# EAGLE design pcb (EAGLE 6.1)
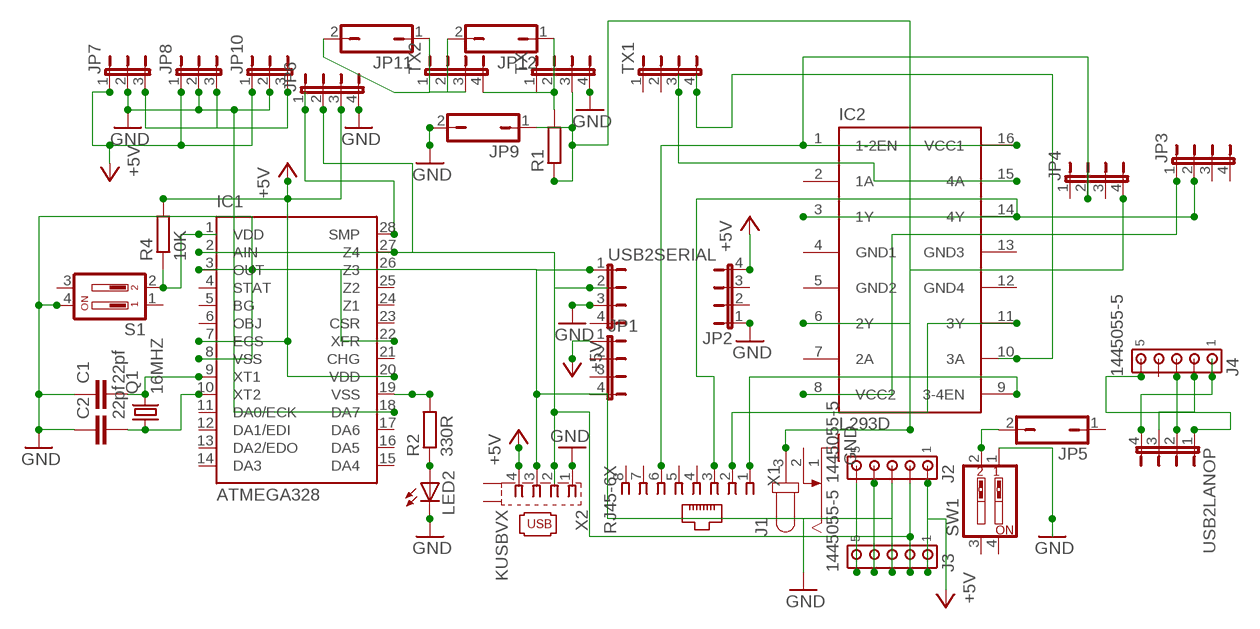
[diagram p0: schematic, sheet 1]

## Parts
C1  22pf  C2.5/2  [C2.5-2]
C2  22pf  C2.5/2  [C2.5-2]
IC1  ATMEGA328  QT9701BD  [DIL28-3]
IC2  L293D  [DIL16]
J1  JACK-PLUG0  [SPC4077]
J2  1445055-5  [1445055-5]
J3  1445055-5  [1445055-5]
J4  1445055-5  [1445055-5]
JP1  JP4E  [JP4]
JP2  JP4E  [JP4]
JP3  JP4E  [JP4]
JP4  JP4E  [JP4]
JP5  JP1Q  [JP1]
JP6  JP4E  [JP4]
JP7  JP2E  [JP2]
JP8  JP2E  [JP2]
JP9  JP1Q  [JP1]
JP10  JP2E  [JP2]
JP11  JP1Q  [JP1]
JP12  JP1Q  [JP1]
LED2  LED3MM  [LED3MM]
Q1  16MHZ  CRYSTALHC49S  [HC49/S]
R1  R-EU_0204/7  [0204/7]
R2  330R  R-EU_0207/10  [0207/10]
R4  10K  R-EU_0207/10  [0207/10]
S1  DP02  [DP-02]
SW1  SW_DIP-2  [EDG-02]
TX  JP4E  [JP4]
TX1  JP4E  [JP4]
TX2  JP4E  [JP4]
USB2LANOP  JP4E  [JP4]
USB2SERIAL  JP4E  [JP4]
X1  RJ45-6X  [RJ45-NO-SHIELD]
X2  KUSBVX  [KUSBVX]

## Nets
+5V: IC1.7(ECS) IC1.20(VDD) J2.1 J3.1 JP1.1 JP2.4 JP6.3 JP7.1 JP8.1 JP10.1 R4.2 X2.4
GND: C1.1 C2.1 IC1.8(VSS) IC1.18(DA7) IC1.22(XFR) J1.1 J2.5 J3.5 JP2.1 JP6.4 JP7.2 JP8.2 JP9.2 JP10.2 LED2.K(C) S1.4 SW1.1 TX.4 USB2SERIAL.3 X2.1
N$1: C1.2 IC1.9(XT1) Q1.2
N$2: C2.2 IC1.10(XT2) Q1.1
N$3: J4.1 USB2LANOP.4
N$4: IC1.3(OUT) J2.3 J3.3 USB2SERIAL.1 X2.3
N$5: IC1.19(VSS) R2.2
N$6: IC2.9(3-4EN) X1.1
N$7: IC2.11(3Y) X1.2
N$8: IC2.14(4Y) X1.3
N$9: IC2.16(VCC1) X1.6
N$10: IC2.8(VCC2) JP3.1
N$11: IC2.6(2Y) JP4.4
N$12: IC2.3(1Y) JP3.2
N$13: IC2.1(1-2EN) JP4.2
N$14: IC2.10(3A) TX1.4
N$15: IC2.15(4A) TX1.3
N$16: J1.3 JP9.1 R1.1 TX.3
N$17: R1.2 TX.2
N$18: J4.2 USB2LANOP.3
N$19: J4.3 USB2LANOP.2
N$20: IC1.2(AIN) J2.2 J3.2 USB2SERIAL.2 X2.2
N$21: J4.5 USB2LANOP.1
N$22: J2.4 J3.4
N$23: JP5.2 SW1.2
N$24: IC1.27(Z4) JP6.2
N$25: IC1.28(SMP) JP6.1
N$26: JP7.3 JP8.3 JP10.3
N$27: JP11.2 TX2.1
N$28: JP11.1 TX2.2
N$29: JP12.2 TX2.3
N$30: JP12.1 TX2.4
N$31: IC1.1(VDD) R4.1 S1.2
N$32: LED2.A R2.1
Unconnected: IC1.4(STAT) IC1.5(BG) IC1.6(OBJ) IC1.11(DA0/ECK) IC1.12(DA1/EDI) IC1.13(DA2/EDO) IC1.14(DA3) IC1.15(DA4) IC1.16(DA5) IC1.17(DA6) IC1.21(CHG) IC1.23(CSR) IC1.24(Z1) IC1.25(Z2) IC1.26(Z3) IC2.2(1A) IC2.7(2A) J1.2 J4.4 JP1.2 JP1.3 JP1.4 JP2.2 JP2.3 JP3.3 JP3.4 JP4.1 JP4.3 JP5.1 S1.1 S1.3 SW1.3 SW1.4 TX1.1 TX1.2 TX.1 USB2SERIAL.4 X1.4 X1.5 X1.7 X1.8 X2.M1(S1) X2.M2(S2)

## Power pins joined to a net without a drawn wire
GND1: IC2.4(GND1)
GND2: IC2.5(GND2)
GND3: IC2.13(GND3)
GND4: IC2.12(GND4)

## Library data of the parts
C1 C2 = capacitor-wima:C: CAPACITOR naming: grid - package width
IC1 = quantum-research-group:QT9701B: Charge-Transfer Capacitance Sensor IC Source: http://data.qprox.com/downloads/datasheets/qt9701b.pdf; OC_FARNELL: unknown; OC_NEWARK: unknown
IC2 = st-microelectronics:L293D: PUSH-PULL 4 CHANNEL DRIVER; MPN: L293D; OC_FARNELL: 9589619; OC_NEWARK: 56P8249
J1 = con-jack:JACK-PLUG: DC POWER JACK Power Jack, DC, Right Angle, Through Hole, Rated 5A at 16VDC, PC Terminals Distributor: Farnell (www.Farnell.de) Drawing: 84N1161.pdf / 84N1162.pdf Manufacturer: SPC Technology (www.spctechnology.com) Type: SPC4077 / SPC 4078; OC_FARNELL: unknown; OC_NEWARK: unknown
J2-J4 = con-amp:1445055-5: Micro MATE-N-LOK Connectors grid 1.5 mm Source: ENG_CD_1445055_A.pdf
JP1-JP4 JP6 TX TX1 TX2 USB2LANOP USB2SERIAL = jumper:JP4E: JUMPER
JP5 JP9 JP11 JP12 = jumper:JP1Q: JUMPER
JP7 JP8 JP10 = jumper:JP2E: JUMPER
LED2 = led:LED: LED OSRAM: - CHIPLED LG R971, LG N971, LY N971, LG Q971, LY Q971, LO R971, LY R971 LH N974, LH R974 LS Q976, LO Q976, LY Q976 LO Q996 - Hyper CHIPLED LW Q18S LB Q993, LB Q99A, LB R99A - SideLED LS A670, LO A670, LY A670, LG A670, LP A670 LB A673, LV A673, LT A673, LW A673 LH A674 LY A675 LS A676, LA A676, LO A676, LY A676, LW A676 LS A679, LY A679, LG A679 - Hyper Micro SIDELED® LS Y876, LA Y876, LO Y876, LY Y876 LT Y87S - SmartLED LW L88C, LW L88S LB L89C, LB L89S, LG L890 LS L89K, LO L89K, LY L89K LS L896, LA L896, LO L896, LY L896 - TOPLED LS T670, LO T670, LY T670, LG T670, LP T670 LSG T670, LSP T670, LSY T670, LOP T670, LYG T670 LG T671, LOG T671, LSG T671 LB T673, LV T673, LT T673, LW T673 LH T674 LS T676, LA T676, LO T676, LY T676, LB T676, LH T676, LSB T676, LW T676 LB T67C, LV T67C, LT T67C, LS T67K, LO T67K, LY T67K, LW E67C LS E67B, LA E67B, LO E67B, LY E67B, LB E67C, LV E67C, LT E67C LW T67C LS T679, LY T679, LG T679 LS T770, LO T770, LY T770, LG T770, LP T770 LB T773, LV T773, LT T773, LW T773 LH T774 LS E675, LA E675, LY E675, LS T675 LS T776, LA T776, LO T776, LY T776, LB T776 LHGB T686 LT T68C, LB T68C - Hyper Mini TOPLED® LB M676 - Mini TOPLED Santana® LG M470 LS M47K, LO M47K, LY M47K Source: http://www.osram.convergy.de LUXEON: - LUMILED® LXK2-PW12-R00, LXK2-PW12-S00, LXK2-PW14-U00, LXK2-PW14-V00 LXK2-PM12-R00, LXK2-PM12-S00, LXK2-PM14-U00 LXK2-PE12-Q00, LXK2-PE12-R00, LXK2-PE12-S00, LXK2-PE14-T00, LXK2-PE14-U00 LXK2-PB12-K00, LXK2-PB12-L00, LXK2-PB12-M00, LXK2-PB14-N00, LXK2-PB14-P00, LXK2-PB14-Q00 LXK2-PR12-L00, LXK2-PR12-M00, LXK2-PR14-Q00, LXK2-PR14-R00 LXK2-PD12-Q00, LXK2-PD12-R00, LXK2-PD12-S00 LXK2-PH12-R00, LXK2-PH12-S00 LXK2-PL12-P00, LXK2-PL12-Q00, LXK2-PL12-R00 Source: www.luxeon.com KINGBRIGHT: KA-3528ASYC Source: www.kingbright.com
Q1 = crystal:CRYSTAL: CRYSTAL; OC_FARNELL: 1667008; OC_NEWARK: unknown
R1 R2 R4 = rcl:R-EU_: RESISTOR, European symbol
S1 = switch-dil:DP02: DIL/CODE SWITCH; MPN: MCDP02; OC_FARNELL: 1255233; OC_NEWARK: 26M1095
SW1 = special:SW_DIP-2: DIP SWITCH
X1 = con-tycoelectronics:RJ45: CORCOM Modular RJ Jacks No Shield Source: www.tycoelectronics.com .. ENG_DS_1654001_1099_RJ_L_0507.pdf; MPN: RJ45-6X; OC_FARNELL: unknown; OC_NEWARK: 01P1604
X2 = con-kycon:KUSBVX: Vertical,Top Entry Universal Serial Bus Connector KUSBVX Series Source: KYCON Sibalco USB vertical socket KUSBV.pdf

## Board
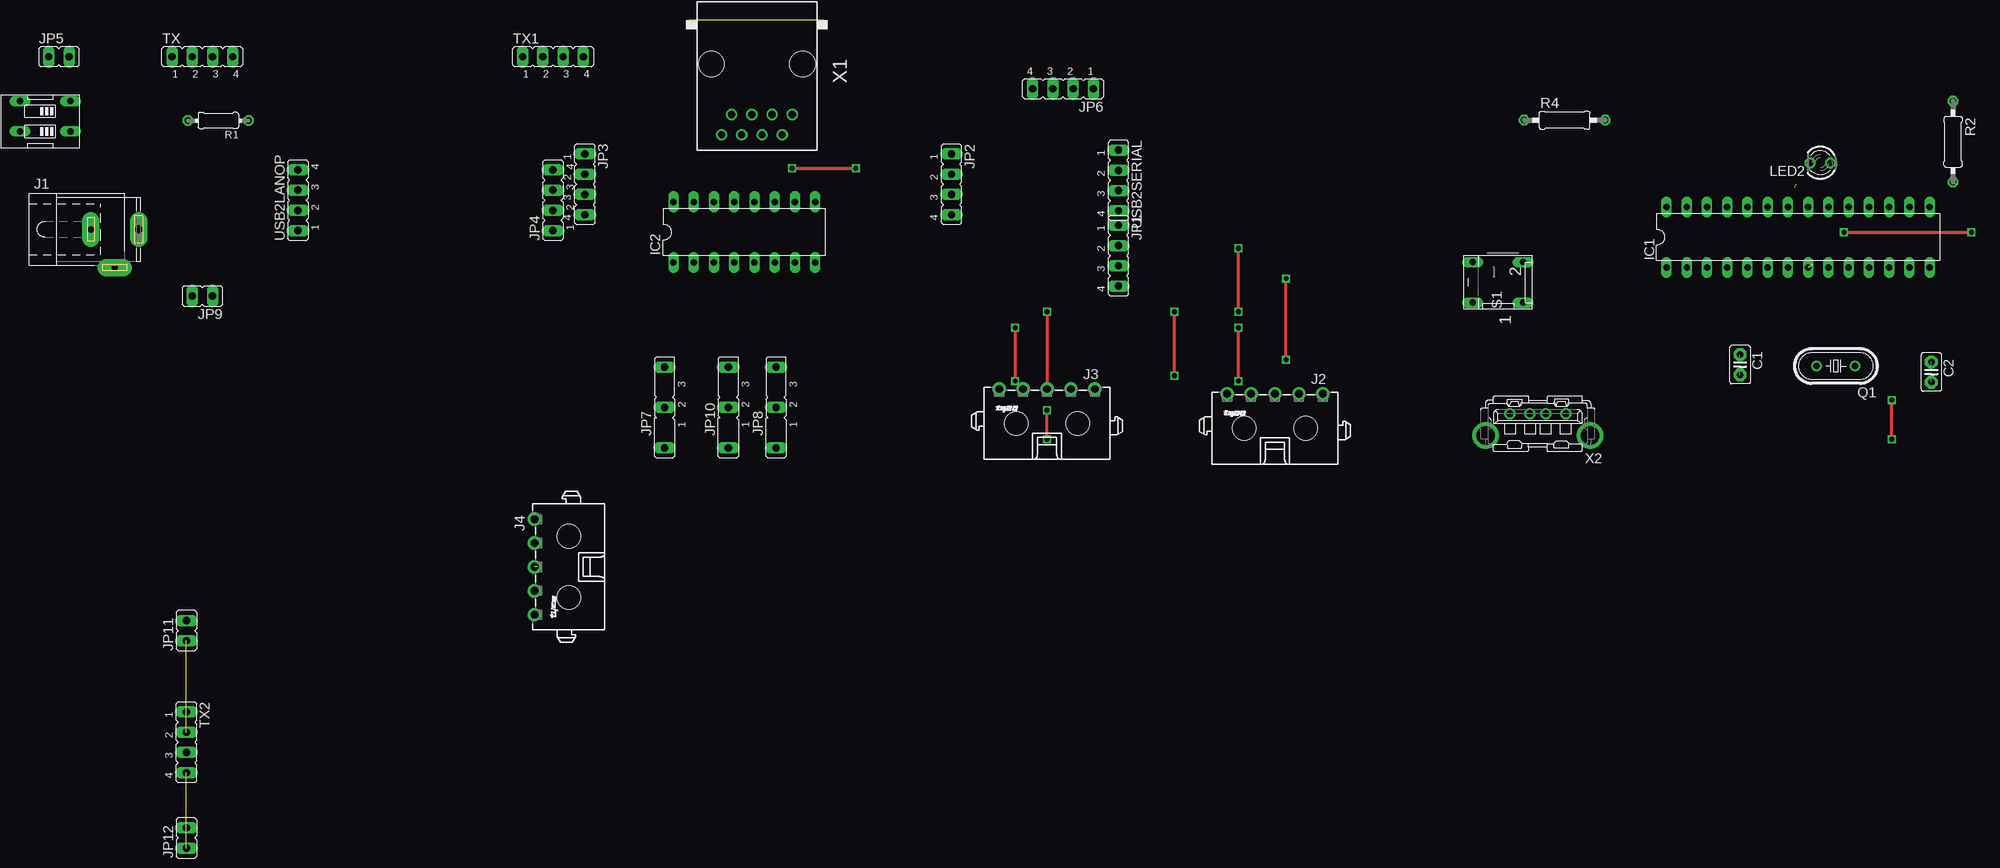
[diagram p1: board, top side]
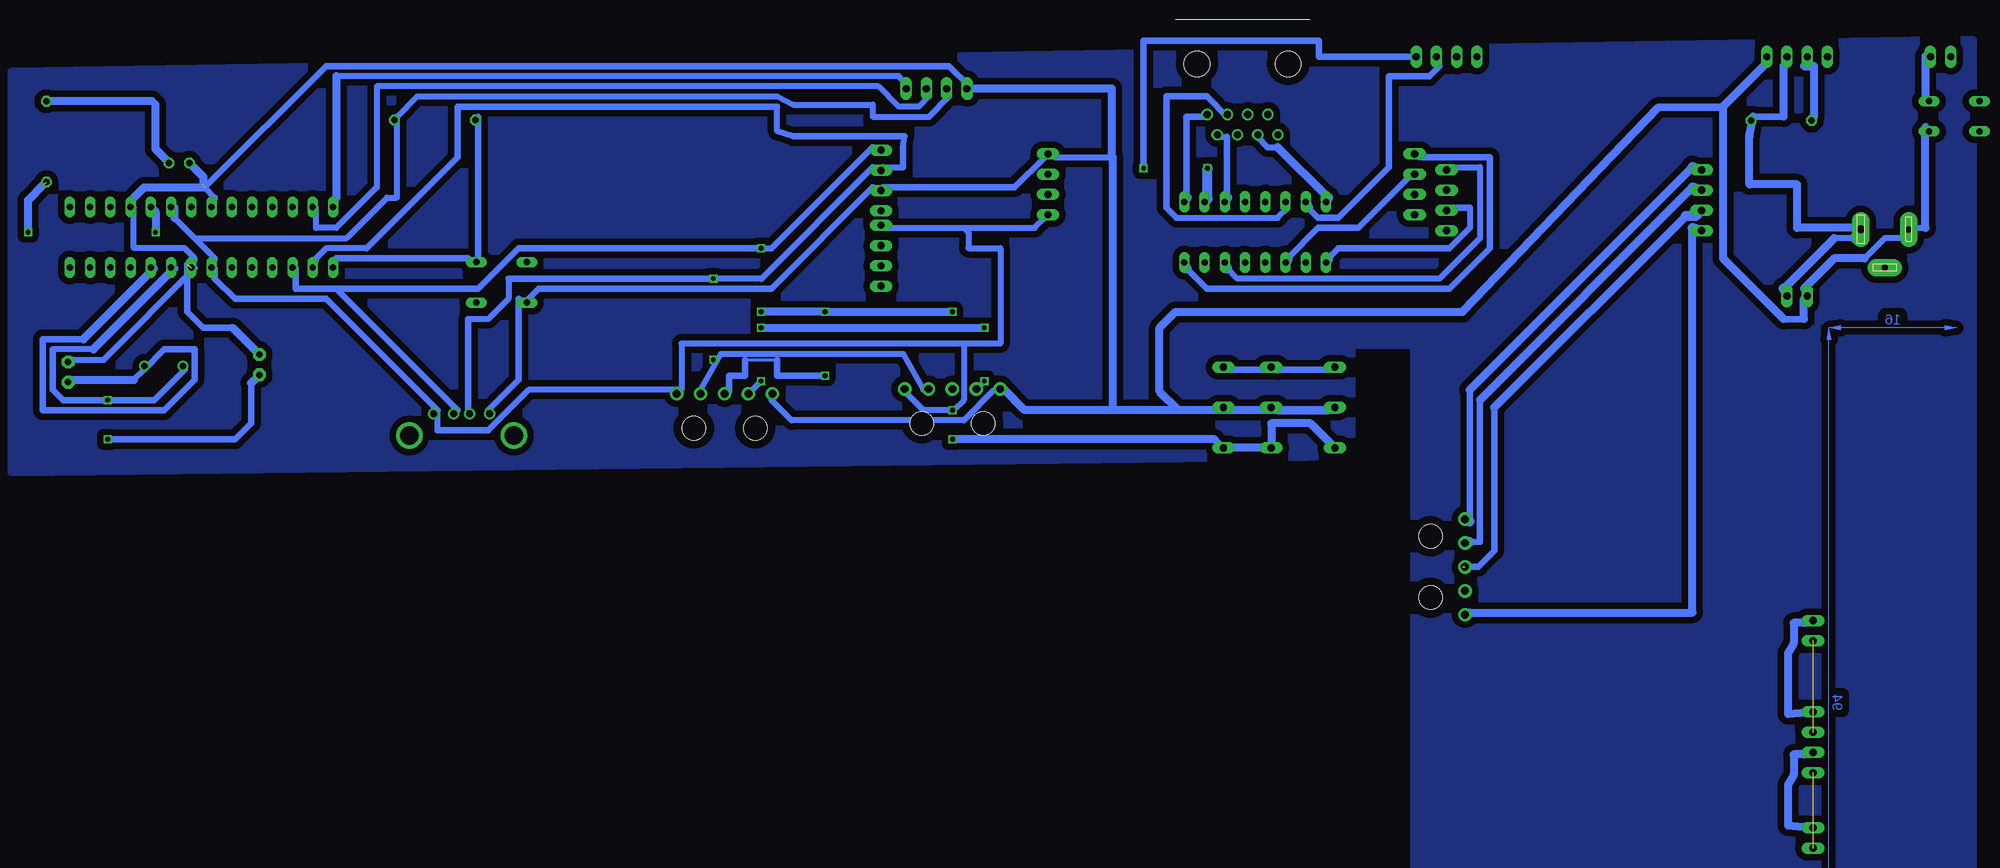
[diagram p2: board, bottom side, seen from below]

Size 16.89 x 0 mm. Coordinates in mm from the lower left corner, seen from the top.
Copper layers (1*16): Top 0.035mm / dielectric 1.5mm / Bottom 0.035mm
Design rules: minimum track width 30mil, minimum drill 24mil, track to track 8mil, track to pad 8mil, pad to pad 8mil, via to via 8mil, smd to smd 8mil, copper to edge 40mil, drill to drill 8mil, minimum pad ring 10mil, minimum via ring 8mil, stop-mask expansion 4mil, vias tented up to drill 0mil, thermal gap 10mil

### Footprints (pad centres in the part's own frame; a part is rotated, then mirrored left to right if it is on the bottom)
C2.5-2 = drill 0.813 pad 1.6 octagon: 1 -1.27,0; 2 1.27,0
DIL28-3 = drill 0.813 long: 1 -16.51,-3.81; 2 -13.97,-3.81; 3 -11.43,-3.81; 4 -8.89,-3.81; 5 -6.35,-3.81; 6 -3.81,-3.81; 7 -1.27,-3.81; 8 1.27,-3.81; 9 3.81,-3.81; 10 6.35,-3.81; 11 8.89,-3.81; 12 11.43,-3.81; 13 13.97,-3.81; 14 16.51,-3.81; 15 16.51,3.81; 16 13.97,3.81; 17 11.43,3.81; 18 8.89,3.81; 19 6.35,3.81; 20 3.81,3.81; 21 1.27,3.81; 22 -1.27,3.81; 23 -3.81,3.81; 24 -6.35,3.81; 25 -8.89,3.81; 26 -11.43,3.81; 27 -13.97,3.81; 28 -16.51,3.81
DIL16 = drill 0.813 long: 1 -8.89,-3.81; 2 -6.35,-3.81; 3 -3.81,-3.81; 4 -1.27,-3.81; 5 1.27,-3.81; 6 3.81,-3.81; 7 6.35,-3.81; 8 8.89,-3.81; 9 8.89,3.81; 10 6.35,3.81; 11 3.81,3.81; 12 1.27,3.81; 13 -1.27,3.81; 14 -3.81,3.81; 15 -6.35,3.81; 16 -8.89,3.81
SPC4077 = drill 0.8 pad 2.184 long: 1 -3,0; 2 0,-4.8 | drill 1 pad 2.184 long: 3 3,0
1445055-5 = drill 1 pad 1.676: 1 6,4.32; 2 3,4.32; 3 0,4.32; 4 -3,4.32; 5 -6,4.32 | hole 3: -3.85,0; 3.85,0
JP4 = drill 0.914 long: 1 -3.81,0; 2 -1.27,0; 3 1.27,0; 4 3.81,0
JP1 = drill 0.914 long: 1 0,-1.27; 2 0,1.27
JP2 = drill 0.914 long: 1 -5.08,0; 2 0,0; 3 5.08,0
LED3MM = drill 0.813 octagon: A -1.27,0; K 1.27,0
HC49/S = drill 0.813: 1 -2.413,0; 2 2.413,0
0204/7 = drill 0.813 octagon: 1 -3.81,0; 2 3.81,0
0207/10 = drill 0.813 octagon: 1 -5.08,0; 2 5.08,0
DP-02 = drill 0.813 long: 1 -2.54,-2.54; 2 2.54,-2.54; 3 2.54,3.81; 4 -2.54,3.81
EDG-02 = drill 0.813 long: 1 -1.27,-3.81; 2 2.54,-3.81; 3 2.54,2.54; 4 -1.27,2.54
RJ45-NO-SHIELD = drill 0.9 pad 1.4: 1 -4.445,6.35; 2 -3.175,8.89; 3 -1.905,6.35; 4 -0.635,8.89; 5 0.635,6.35; 6 1.905,8.89; 7 3.175,6.35; 8 4.445,8.89 | hole 3.251: -5.715,0; 5.715,0
KUSBVX = drill 0.9 pad 1.3: 1 3.5,0; 2 1,0; 3 -1,0; 4 -3.5,0 | drill 2.3 pad 2.8: M1 -6.57,2.71; M2 6.57,2.71

### Placement (x,y rotation side)
C1  131.82,-43.25 270 top  (outside the outline)
C2  155.82,-44.17 270 top  (outside the outline)
IC1  139.11,-27.25 0 top  (outside the outline)
IC2  6.86,-26.62 0 top  (outside the outline)
J1  -72.13,-26.27 0 top  (outside the outline)
J2  73.46,-51.22 0 top  (outside the outline)
J3  44.86,-50.62 0 top  (outside the outline)
J4  -15.14,-68.62 90 top  (outside the outline)
JP1  53.82,-29.57 270 top  (outside the outline)
JP2  32.86,-20.62 270 top  (outside the outline)
JP3  -13.14,-20.62 270 top  (outside the outline)
JP4  -17.14,-22.62 90 top  (outside the outline)
JP5  -79.14,-4.62 270 top  (outside the outline)
JP6  46.86,-8.62 180 top  (outside the outline)
JP7  -3.14,-48.62 90 top  (outside the outline)
JP8  10.86,-48.62 90 top  (outside the outline)
JP9  -61.14,-34.62 90 top  (outside the outline)
JP10  4.86,-48.62 90 top  (outside the outline)
JP11  -63.14,-76.62 0 top  (outside the outline)
JP12  -63.14,-102.62 0 top  (outside the outline)
LED2  141.88,-17.93 180 top  (outside the outline)
Q1  143.85,-43.42 180 top  (outside the outline)
R1  -59.14,-12.62 180 top  (outside the outline)
R2  158.55,-15.28 270 top  (outside the outline)
R4  109.81,-12.58 0 top  (outside the outline)
S1  102.06,-32.91 90 top  (outside the outline)
SW1  -81.49,-12.72 90 top  (outside the outline)
TX  -61.14,-4.62 0 top  (outside the outline)
TX1  -17.14,-4.62 0 top  (outside the outline)
TX2  -63.14,-90.62 270 top  (outside the outline)
USB2LANOP  -49.14,-22.62 90 top  (outside the outline)
USB2SERIAL  53.82,-20.14 270 top  (outside the outline)
X1  8.45,-5.51 180 top  (outside the outline)
X2  106.45,-49.42 180 top  (outside the outline)

### Tracks (layer width: path | path; a pad name or v marks a point on that pad's centre or on a via)
+5V  (via drill 0.6)
  Top 0.406: v44.86,-52.62 v44.86,-48.96
  Bottom 0.762: 109.47,-51.5 109.47,-48.96 X2.4 | 103.12,-51.5 98.04,-46.42 78.99,-46.42 | 43.43,-26.1 53.59,-26.1 JP1.1 | 43.43,-26.1 34.54,-26.1 33.27,-24.83 JP2.4 | 43.43,-26.1 42.86,-26.62 42.86,-28.62 38.86,-28.62 38.86,-40.61 43.43,-40.61 | 43.43,-40.61 43.43,-47.69 44.7,-48.96 v44.86,-48.96 48.51,-48.96 51.05,-46.42 J3.1 | 78.99,-46.42 78.86,-46.42 78.86,-40.62 77.18,-40.61 43.43,-40.61 | 78.99,-46.42 J2.1 | 137.41,-29.91 IC1.7 137.41,-31.18 | 142.49,-23.56 IC1.20 | 114.55,-12.13 114.55,-22.29 115.82,-22.29 120.9,-27.37 139.95,-27.37 | 47.81,-12.13 54.86,-12.13 54.86,-10.62 64.86,-10.62 66.86,-9.59 112.01,-9.59 114.55,-12.13 | 45.27,-9.59 JP6.3 | 114.55,-12.13 R4.2
  Bottom 0.813: 103.12,-51.5 109.47,-51.5 | 142.49,-24.83 139.95,-27.37 137.41,-29.91 | 47.81,-12.13 45.27,-9.59 | 109.47,-48.96 123.44,-34.99 134.87,-34.99 137.41,-32.45 137.41,-31.18 | JP8.1 11.94,-52.62
  Bottom 1.016: 142.49,-23.56 142.49,-24.83 | JP7.1 -0.06,-50.62 4.86,-50.62 JP10.1 JP8.1 | 11.94,-52.62 v44.86,-52.62
GND  (2 unrouted)
  Bottom 0.762: 138.68,-21.02 137.41,-22.29 IC1.22 | 147.57,-22.29 IC1.18 147.57,-23.56 147.57,-28.64 141.22,-28.64 139.95,-29.91 IC1.8 139.95,-31.18 | 151.38,-42.61 155.19,-42.61 C2.1 | 99.31,-34.99 S1.4 98.04,-34.99 | 103.12,-48.96 X2.1 | 24.73,-17.21 32,-17.21 JP2.1 33.27,-17.21 | 42.73,-9.59 JP6.4 42.73,-8.32 | 53.59,-21.02 USB2SERIAL.3 54.86,-21.02 | -75.95,-26.1 -77.22,-26.1 | -77.22,-13.4 SW1.1 | -69.6,-29.91 -72.14,-27.37 -74.68,-27.37 | -61.98,-33.72 JP9.2 -61.98,-34.99 | -2.29,-48.96 JP7.2 -3.56,-48.96 | 4.06,-48.96 JP10.2 5.33,-48.96 | 10.41,-48.96 JP8.2 11.68,-48.96 | -56.9,-5.78 TX.4 | 38.35,-46.42 J3.5 39.62,-46.42 43.43,-50.23 65.02,-50.23 67.56,-47.69 J2.5
  Bottom 0.813: 151.38,-42.61 139.95,-31.18 | 99.31,-34.99 99.31,-45.15 103.12,-48.96 | 24.73,-17.21 24.86,-17.21 | 42.86,-8.62 42.73,-9.59 | 53.59,-21.02 37.08,-21.02 33.27,-17.21 | 98.04,-34.99 96.77,-33.72 67.56,-33.72 54.86,-21.02 | 138.68,-21.02 123.44,-5.78 45.27,-5.78 42.73,-8.32 | -59.44,-37.53 -61.98,-37.53 | 135.18,-38.62 138.86,-38.62 140.86,-36.62 140.86,-30.62
  Bottom 1.016: 138.68,-21.02 146.3,-21.02 147.57,-22.29 | 24.86,-17.21 24.86,-8.62 42.86,-8.62 | -77.22,-26.1 -77.22,-13.4 | -75.95,-26.1 J1.1 -74.68,-27.37 | -61.98,-33.72 -65.79,-29.91 -69.6,-29.91 | 4.06,-48.96 -2.29,-48.96 | 5.33,-48.96 10.41,-48.96 | -51.82,-10.86 -43.72,-10.96 -19.14,-36.62 16.86,-36.62 18.86,-38.62 18.86,-46.62 16.52,-48.96 -3.56,-48.96 | -51.82,-10.86 -56.9,-5.78 | 38.35,-46.42 35.81,-48.96 24.73,-48.96 | 11.68,-48.96 24.73,-48.96 | -61.98,-37.53 -61.98,-34.99 | -59.44,-37.53 -51.82,-29.91 -51.82,-10.86 | 24.73,-48.96 24.73,-17.21 | LED2.K 138.86,-19.68 138.86,-20.62 | C1.1 135.18,-38.62
N$1  (via drill 0.6)
  Top 0.406: v150.86,-52.62 v150.86,-47.69
  Bottom 0.762: 157.73,-46.42 156.46,-47.69 | 152.65,-41.34 157.73,-41.34 | 141.22,-43.88 Q1.2 | 142.49,-31.18 IC1.9
  Bottom 0.813: 141.22,-43.88 145.03,-47.69 v150.86,-47.69 156.46,-47.69 | 157.73,-41.34 157.73,-46.42 | 132.86,-45.56 132.86,-50.62 134.86,-52.62 v150.86,-52.62
  Bottom 1.016: 142.49,-31.18 152.65,-41.34 | C1.2 132.86,-45.56
N$2
  Bottom 0.762: 147.57,-45.15 146.3,-43.88 Q1.1 | 155.19,-45.15 C2.2 | 145.03,-31.18 IC1.10
  Bottom 0.813: 153.92,-40.07 159,-40.07 159,-48.96 143.76,-48.96 139.95,-45.15 139.95,-41.34 143.76,-41.34 146.3,-43.88
  Bottom 1.016: 155.19,-45.15 147.57,-45.15 | 153.92,-40.07 145.03,-31.18
N$3
  Bottom 0.813: -20.07,-62.93 -20.07,-46.42
  Bottom 1.016: -20.07,-46.42 -48.01,-18.48
  Bottom 1.27: -48.01,-18.48 USB2LANOP.4 | -20.07,-62.93 J4.1
N$4  (via drill 0.6)
  Top 0.406: v60.86,-44.62 v60.86,-36.62 | v44.86,-36.62 J3.3 | v68.86,-36.62 v68.86,-28.64
  Bottom 0.406: 70.86,-42.62 66.86,-42.62
  Bottom 0.762: 127.25,-31.18 IC1.3 | 106.93,-48.96 X2.3 | v68.86,-28.64 67.56,-28.64 | 54.86,-15.94 USB2SERIAL.1
  Bottom 0.813: 127.25,-31.18 127.25,-33.72 122.17,-33.72 | 106.93,-48.96 122.17,-33.72 | 67.56,-28.64 54.86,-15.94 | v68.86,-28.64 99.31,-28.64 104.39,-33.72 122.17,-33.72 | J2.3 72.86,-46.62 72.86,-44.62 70.86,-44.62 70.86,-42.62 | 66.86,-42.62 66.86,-44.62 v60.86,-44.62
  Bottom 1.016: v44.86,-36.62 v60.86,-36.62 v68.86,-36.62
N$5  (via drill 0.6)  (1 unrouted)
  Top 0.406: v144.86,-26.62 v160.86,-26.62
  Bottom 1.016: IC1.19 144.86,-24.04 v144.86,-26.62 | v160.86,-26.62 160.86,-22.62 158.86,-20.62
N$6
  Bottom 0.762: 12.95,-12.13 X1.1
  Bottom 0.813: 15.49,-22.29 15.49,-12.13 12.95,-12.13
  Bottom 1.27: 15.49,-22.29 IC2.9
N$7
  Bottom 0.762: 10.41,-14.67 11.68,-14.67 X1.2
  Bottom 0.813: 10.41,-14.67 10.41,-22.29
  Bottom 1.27: 10.41,-22.29 IC2.11
N$8
  Bottom 0.762: 18.03,-23.56 16.76,-24.83 4.06,-24.83 2.79,-23.56 IC2.14 | 10.41,-12.13 X1.3
  Bottom 0.813: 18.03,-23.56 18.03,-9.59 12.95,-9.59 10.41,-12.13
N$9
  Bottom 0.762: 5.33,-15.94 4.06,-15.94 | 6.6,-14.67 X1.6
  Bottom 0.813: 6.6,-14.67 5.33,-15.94
  Bottom 1.016: 4.06,-15.94 -2.29,-22.29
  Bottom 1.27: -2.29,-22.29 IC2.16
N$10
  Bottom 0.762: -13.72,-17.21 JP3.1
  Bottom 0.813: 15.49,-31.18 12.95,-33.72 -17.53,-33.72 -22.61,-28.64 -22.61,-17.21 -13.72,-17.21
  Bottom 1.27: 15.49,-31.18 IC2.8
N$11
  Bottom 0.762: 10.41,-31.18 9.14,-32.45 -16.26,-32.45 -21.34,-27.37 -21.34,-18.48 -17.53,-18.48 JP4.4
  Bottom 1.27: 10.41,-31.18 IC2.6
N$12
  Bottom 0.762: -12.45,-19.75 JP3.2
  Bottom 0.813: 2.79,-29.91 -1.02,-26.1 -6.1,-26.1 -12.45,-19.75
  Bottom 1.27: 2.79,-29.91 IC2.3
N$13
  Bottom 0.762: -3.56,-28.64 -2.29,-29.91 | -20.07,-23.56 -20.07,-26.1 | -17.53,-23.56 JP4.2
  Bottom 0.813: -3.56,-28.64 -17.53,-28.64 -20.07,-26.1 | -17.53,-23.56 -20.07,-23.56
  Bottom 1.27: -2.29,-29.91 IC2.1
N$14  (via drill 0.6)
  Top 0.406: v12.86,-18.62 v20.86,-18.62
  Bottom 0.406: IC2.10 12.86,-22.46
  Bottom 0.813: v20.86,-18.62 20.86,-2.62 -1.14,-2.62 -1.14,-4.62 TX1.4
  Bottom 1.27: 12.86,-22.46 v12.86,-18.62
N$15
  Bottom 0.762: -1.02,-24.83 0.25,-23.56 | -14.99,-7.05 -16.26,-5.78 TX1.3
  Bottom 0.813: -1.02,-24.83 -3.56,-24.83 -9.91,-18.48 -9.91,-7.05 -14.99,-7.05
  Bottom 1.27: 0.25,-23.56 IC2.15
N$16
  Bottom 0.762: -69.6,-26.1 J1.3 | -68.33,-27.37 -65.79,-27.37 | -59.44,-5.78 TX.3 | -55.63,-12.13 R1.1
  Bottom 0.813: -55.63,-12.13 -59.44,-12.13
  Bottom 1.016: -69.6,-26.1 -61.14,-26.1 -61.14,-20.62 -55.14,-20.62 -55.14,-14.62 -55.63,-12.13 | -65.79,-27.37 -59.44,-33.72 | -59.44,-12.13 -59.44,-5.78
  Bottom 1.27: -59.44,-33.72 JP9.1 | -68.33,-27.37 J1.3
N$17
  Bottom 0.762: -63.25,-12.13 R1.2 | -61.98,-5.78 TX.2
  Bottom 1.016: -63.25,-12.13 -63.25,-5.78 -61.98,-5.78
N$18
  Bottom 0.762: -20.07,-65.47 -21.34,-65.47
  Bottom 0.813: -21.34,-65.47 -21.34,-47.69
  Bottom 1.016: -21.34,-47.69 -48.01,-21.02
  Bottom 1.27: -48.01,-21.02 USB2LANOP.3 | -20.07,-65.47 J4.2
N$19  (1 unrouted)
  Bottom 0.813: -23.14,-48.62 -23.14,-66.62 -21.14,-68.62 -19.14,-68.62
  Bottom 1.016: -47.14,-24.62 -23.14,-48.62
  Bottom 1.27: USB2LANOP.2 -48.41,-24.62 -47.14,-24.62
N$20  (via drill 0.6)
  Top 0.406: v74.86,-42.62 v74.86,-32.45
  Bottom 0.406: 73.91,-41.88 74.65,-42.62 v74.86,-42.62
  Bottom 0.762: 118.36,-28.64 123.44,-28.64 124.71,-29.91 IC1.2 | 51.05,-15.94 50.86,-14.62 | 64.86,-14.62 66.86,-13.94 66.86,-10.86 | 51.05,-18.48 53.59,-18.48 USB2SERIAL.2 | 105.66,-37.53 103.12,-37.53 100.58,-34.99 100.58,-32.45 | 68.83,-32.45 v74.86,-32.45 | 105.66,-48.96 X2.2 | J3.2 48.51,-46.42 51.05,-41.88 73.91,-41.88 76.45,-46.42 J2.2
  Bottom 0.813: 118.36,-28.64 106.93,-17.21 106.93,-10.86 66.86,-10.86 | 50.86,-14.62 64.86,-14.62 | 51.05,-18.48 51.05,-15.94 | 105.66,-37.53 105.66,-48.96 | v74.86,-32.45 100.58,-32.45 | 68.83,-32.45 54.86,-18.48 USB2SERIAL.2
N$21
  Bottom 0.762: -20.07,-74.36 J4.5
  Bottom 1.016: -48.01,-26.1 -48.01,-74.36 -20.07,-74.36
  Bottom 1.27: -48.01,-26.1 USB2LANOP.1
N$22  (via drill 0.6)
  Top 0.406: v68.86,-45.3 v68.86,-38.62 | v40.86,-38.62 v40.86,-45.3
  Bottom 0.813: J2.4 v68.86,-45.3 | J3.4 v40.86,-45.3
  Bottom 1.016: v68.86,-38.62 v40.86,-38.62
N$23
  Bottom 0.762: -77.22,-9.59 SW1.2 | -77.22,-4.51 JP5.2
  Bottom 1.016: -77.22,-4.51 -77.22,-9.59
N$24
  Bottom 0.762: 47.81,-9.59 49.08,-10.86 51.62,-10.86 54.16,-8.32 117.09,-8.32 117.09,-21.02 122.17,-26.1 124.71,-26.1 124.71,-23.56 IC1.27
  Bottom 0.813: 47.81,-9.59 JP6.2
N$25
  Bottom 0.762: 51.62,-7.05 122.17,-7.05 | 122.17,-22.29 IC1.28 | 50.35,-8.32 JP6.1
  Bottom 0.813: 50.35,-8.32 51.62,-7.05
  Bottom 1.016: 122.17,-7.05 122.17,-22.29
N$26
  Bottom 0.762: -2.29,-43.88 JP7.3 | 10.41,-43.88 JP8.3
  Bottom 0.813: 4.06,-43.88 -2.29,-43.88 | 10.41,-43.88 5.33,-43.88 JP10.3
  Bottom 1.016: 4.06,-43.88 JP10.3
N$27
  Bottom 0.762: -61.98,-75.63 JP11.2
  Bottom 1.016: -61.98,-75.63 -60.71,-75.63 -60.71,-78.17 -59.98,-79.44 -59.98,-87.06 TX2.1
N$28  (1 unrouted)
N$29
  Bottom 0.762: -61.98,-92.14 TX2.3
  Bottom 1.016: -61.98,-92.14 -60.71,-92.14 -60.71,-94.68 -59.98,-95.95 -59.98,-101.03 JP12.2
N$30  (1 unrouted)
N$31
  Bottom 0.762: 105.66,-29.91 S1.2 104.39,-29.91 | 122.17,-29.91 IC1.1 | 104.39,-12.13 R4.1
  Bottom 0.813: 122.17,-29.91 105.66,-29.91 | 104.39,-29.91 104.39,-12.13
N$32
  Bottom 0.406: 144.86,-10.62 145.28,-10.2
  Bottom 1.016: LED2.A 144.86,-16.22 144.86,-10.62 | 145.28,-10.2 R2.1
N$33
  pour Bottom (isolate 0.813): -79.14,-152.62 -83.14,-148.62 -83.14,-2.62 162.86,-6.62 162.86,-56.62 -5.14,-54.62 -5.14,-40.62 -13.14,-40.62 -13.14,-148.62 -17.14,-152.62
(copper drawn outside any net)
  shapes: Bottom area x3